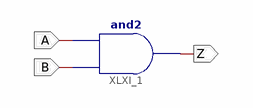
[diagram p0: schematic sheet 1]
// Xilinx ISE schematic And_2.sch (spartan3) as structural Verilog: 1 symbols, 3 ports
module And_2 (
  input  A,
  input  B,
  output Z
);

  and XLXI_1 (Z, B, A);
endmodule
